# Altium schematic sheet ESP32.SchDoc
size A4
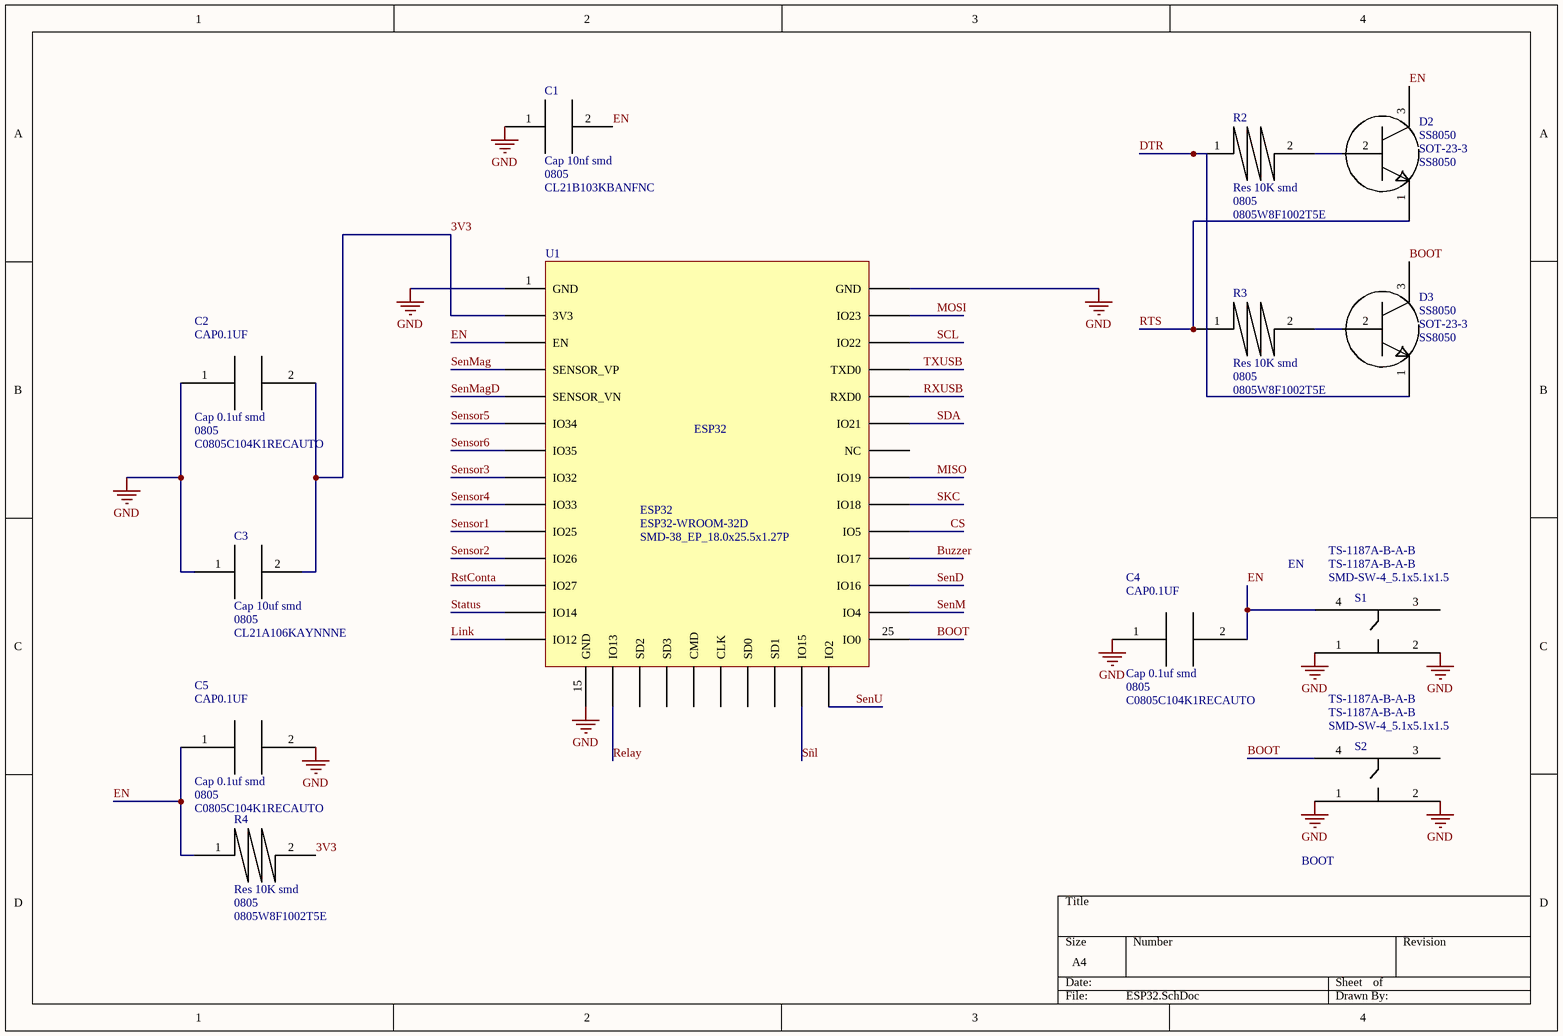
[diagram p0: ESP32.SchDoc]

## Parts
C1  Cap 10nf smd  Package: 0805  MFR.Part #: CL21B103KBANFNC  [CAP10NFSMD]
C2  Cap 0.1uf smd  Package: 0805  MFR.Part #: C0805C104K1RECAUTO  [CAP0.1UFSMD]
C3  Cap 10uf smd  Package: 0805  MFR.Part #: CL21A106KAYNNNE  [CAP10UFSMD]
C4  Cap 0.1uf smd  Package: 0805  MFR.Part #: C0805C104K1RECAUTO  [CAP0.1UFSMD]
C5  Cap 0.1uf smd  Package: 0805  MFR.Part #: C0805C104K1RECAUTO  [CAP0.1UFSMD]
D2  SS8050  Package: SOT-23-3  [SS8050]
D3  SS8050  Package: SOT-23-3  [SS8050]
R2  Res 10K smd  Package: 0805  MFR.Part #: 0805W8F1002T5E  [RES 10K]
R3  Res 10K smd  Package: 0805  MFR.Part #: 0805W8F1002T5E  [RES 10K]
R4  Res 10K smd  Package: 0805  MFR.Part #: 0805W8F1002T5E  [RES 10K]
S1  TS-1187A-B-A-B  Package: SMD-SW-4_5.1x5.1x1.5  [TS-1187A-B-A-B]
S2  TS-1187A-B-A-B  Package: SMD-SW-4_5.1x5.1x1.5  [TS-1187A-B-A-B]
U1  ESP32  Package: SMD-38_EP_18.0x25.5x1.27P  MFR.Part #: ESP32-WROOM-32D  [ESP32]

## Nets
GND: C1.1 C2.1 C3.1 C4.1 C5.2 S1.1 S1.2 S2.1 S2.2 U1.1(GND) U1.15(GND) U1.38(GND)
3V3: C2.2 C3.2 R4.2 U1.2(3V3)
BOOT: D3.3 S2.4 U1.25(IO0)
Buzzer: U1.28(IO17)
CS: U1.29(IO5)
DTR: D3.1 R2.1
EN: C1.2 C4.2 C5.1 D2.3 R4.1 S1.4 U1.3(EN)
Link: U1.14(IO12)
MISO: U1.31(IO19)
MOSI: U1.37(IO23)
Relay: U1.16(IO13)
RstConta: U1.12(IO27)
RTS: D2.1 R3.1
RXUSB: U1.34(RXD0)
SCL: U1.36(IO22)
SDA: U1.33(IO21)
SenD: U1.27(IO16)
SenM: U1.26(IO4)
SenMag: U1.4(SENSOR_VP)
SenMagD: U1.5(SENSOR_VN)
Sensor1: U1.10(IO25)
Sensor2: U1.11(IO26)
Sensor3: U1.8(IO32)
Sensor4: U1.9(IO33)
Sensor5: U1.6(IO34)
Sensor6: U1.7(IO35)
SenU: U1.24(IO2)
SKC: U1.30(IO18)
Status: U1.13(IO14)
Sñl: U1.23(IO15)
TXUSB: U1.35(TXD0)
NetD2_2: D2.2 R2.2
NetD3_2: D3.2 R3.2

Not connected (* = marked no-connect by the designer): S1 3; S2 3; U1 17(SD2) 18(SD3) 19(CMD) 20(CLK) 21(SD0) 22(SD1) 32(NC)

## Notes on the sheet
- EN
- BOOT
- (in symbol Cap 0.1uf smd) CAP0.1UF

## Library data of the parts
C1 = Cap 10nf smd: 10nf
C2 C4 C5 = Cap 0.1uf smd: 0.1uf
C3 = Cap 10uf smd: 10uf
R2-R4 = Res 10K smd: 10K
D2 D3 = SS8050: MFR.Part #: SS8050
S1 S2 = TS-1187A-B-A-B: MFR.Part #: TS-1187A-B-A-B